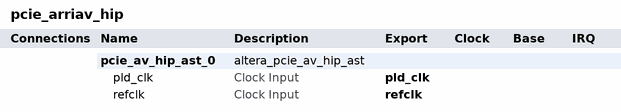
[diagram p0: system contents]
# Platform Designer (Qsys) system pcie_arriav_hip, Arria V 5AGTFC7H3F35I3
# Parameters at their usual value, and those the tool derives, are not listed.
package require -exact qsys 21.1
create_system pcie_arriav_hip
set_project_property DEVICE_FAMILY {Arria V}
set_project_property DEVICE 5AGTFC7H3F35I3

add_instance pcie_av_hip_ast_0 altera_pcie_av_hip_ast 21.1
set_instance_parameter_value pcie_av_hip_ast_0 ACDS_VERSION_HWTCL 21.1
set_instance_parameter_value pcie_av_hip_ast_0 advanced_default_parameter_override 0
set_instance_parameter_value pcie_av_hip_ast_0 altpcie_avmm_hwtcl 0
set_instance_parameter_value pcie_av_hip_ast_0 ast_width_hwtcl {Avalon-ST 64-bit}
set_instance_parameter_value pcie_av_hip_ast_0 bar0_size_mask_0_hwtcl 28
set_instance_parameter_value pcie_av_hip_ast_0 bar0_size_mask_1_hwtcl 28
set_instance_parameter_value pcie_av_hip_ast_0 bar0_size_mask_2_hwtcl 28
set_instance_parameter_value pcie_av_hip_ast_0 bar0_size_mask_3_hwtcl 28
set_instance_parameter_value pcie_av_hip_ast_0 bar0_size_mask_4_hwtcl 28
set_instance_parameter_value pcie_av_hip_ast_0 bar0_size_mask_5_hwtcl 28
set_instance_parameter_value pcie_av_hip_ast_0 bar0_size_mask_6_hwtcl 28
set_instance_parameter_value pcie_av_hip_ast_0 bar0_size_mask_7_hwtcl 28
set_instance_parameter_value pcie_av_hip_ast_0 bar0_type_0_hwtcl 1
set_instance_parameter_value pcie_av_hip_ast_0 bar0_type_1_hwtcl 1
set_instance_parameter_value pcie_av_hip_ast_0 bar0_type_2_hwtcl 1
set_instance_parameter_value pcie_av_hip_ast_0 bar0_type_3_hwtcl 1
set_instance_parameter_value pcie_av_hip_ast_0 bar0_type_4_hwtcl 1
set_instance_parameter_value pcie_av_hip_ast_0 bar0_type_5_hwtcl 1
set_instance_parameter_value pcie_av_hip_ast_0 bar0_type_6_hwtcl 1
set_instance_parameter_value pcie_av_hip_ast_0 bar0_type_7_hwtcl 1
set_instance_parameter_value pcie_av_hip_ast_0 bar1_size_mask_0_hwtcl 0
set_instance_parameter_value pcie_av_hip_ast_0 bar1_size_mask_1_hwtcl 0
set_instance_parameter_value pcie_av_hip_ast_0 bar1_size_mask_2_hwtcl 0
set_instance_parameter_value pcie_av_hip_ast_0 bar1_size_mask_3_hwtcl 0
set_instance_parameter_value pcie_av_hip_ast_0 bar1_size_mask_4_hwtcl 0
set_instance_parameter_value pcie_av_hip_ast_0 bar1_size_mask_5_hwtcl 0
set_instance_parameter_value pcie_av_hip_ast_0 bar1_size_mask_6_hwtcl 0
set_instance_parameter_value pcie_av_hip_ast_0 bar1_size_mask_7_hwtcl 0
set_instance_parameter_value pcie_av_hip_ast_0 bar1_type_0_hwtcl 0
set_instance_parameter_value pcie_av_hip_ast_0 bar1_type_1_hwtcl 0
set_instance_parameter_value pcie_av_hip_ast_0 bar1_type_2_hwtcl 0
set_instance_parameter_value pcie_av_hip_ast_0 bar1_type_3_hwtcl 0
set_instance_parameter_value pcie_av_hip_ast_0 bar1_type_4_hwtcl 0
set_instance_parameter_value pcie_av_hip_ast_0 bar1_type_5_hwtcl 0
set_instance_parameter_value pcie_av_hip_ast_0 bar1_type_6_hwtcl 0
set_instance_parameter_value pcie_av_hip_ast_0 bar1_type_7_hwtcl 0
set_instance_parameter_value pcie_av_hip_ast_0 bar2_size_mask_0_hwtcl 0
set_instance_parameter_value pcie_av_hip_ast_0 bar2_size_mask_1_hwtcl 0
set_instance_parameter_value pcie_av_hip_ast_0 bar2_size_mask_2_hwtcl 0
set_instance_parameter_value pcie_av_hip_ast_0 bar2_size_mask_3_hwtcl 0
set_instance_parameter_value pcie_av_hip_ast_0 bar2_size_mask_4_hwtcl 0
set_instance_parameter_value pcie_av_hip_ast_0 bar2_size_mask_5_hwtcl 0
set_instance_parameter_value pcie_av_hip_ast_0 bar2_size_mask_6_hwtcl 0
set_instance_parameter_value pcie_av_hip_ast_0 bar2_size_mask_7_hwtcl 0
set_instance_parameter_value pcie_av_hip_ast_0 bar2_type_0_hwtcl 0
set_instance_parameter_value pcie_av_hip_ast_0 bar2_type_1_hwtcl 0
set_instance_parameter_value pcie_av_hip_ast_0 bar2_type_2_hwtcl 0
set_instance_parameter_value pcie_av_hip_ast_0 bar2_type_3_hwtcl 0
set_instance_parameter_value pcie_av_hip_ast_0 bar2_type_4_hwtcl 0
set_instance_parameter_value pcie_av_hip_ast_0 bar2_type_5_hwtcl 0
set_instance_parameter_value pcie_av_hip_ast_0 bar2_type_6_hwtcl 0
set_instance_parameter_value pcie_av_hip_ast_0 bar2_type_7_hwtcl 0
set_instance_parameter_value pcie_av_hip_ast_0 bar3_size_mask_0_hwtcl 0
set_instance_parameter_value pcie_av_hip_ast_0 bar3_size_mask_1_hwtcl 0
set_instance_parameter_value pcie_av_hip_ast_0 bar3_size_mask_2_hwtcl 0
set_instance_parameter_value pcie_av_hip_ast_0 bar3_size_mask_3_hwtcl 0
set_instance_parameter_value pcie_av_hip_ast_0 bar3_size_mask_4_hwtcl 0
set_instance_parameter_value pcie_av_hip_ast_0 bar3_size_mask_5_hwtcl 0
set_instance_parameter_value pcie_av_hip_ast_0 bar3_size_mask_6_hwtcl 0
set_instance_parameter_value pcie_av_hip_ast_0 bar3_size_mask_7_hwtcl 0
set_instance_parameter_value pcie_av_hip_ast_0 bar3_type_0_hwtcl 0
set_instance_parameter_value pcie_av_hip_ast_0 bar3_type_1_hwtcl 0
set_instance_parameter_value pcie_av_hip_ast_0 bar3_type_2_hwtcl 0
set_instance_parameter_value pcie_av_hip_ast_0 bar3_type_3_hwtcl 0
set_instance_parameter_value pcie_av_hip_ast_0 bar3_type_4_hwtcl 0
set_instance_parameter_value pcie_av_hip_ast_0 bar3_type_5_hwtcl 0
set_instance_parameter_value pcie_av_hip_ast_0 bar3_type_6_hwtcl 0
set_instance_parameter_value pcie_av_hip_ast_0 bar3_type_7_hwtcl 0
set_instance_parameter_value pcie_av_hip_ast_0 bar4_size_mask_0_hwtcl 0
set_instance_parameter_value pcie_av_hip_ast_0 bar4_size_mask_1_hwtcl 0
set_instance_parameter_value pcie_av_hip_ast_0 bar4_size_mask_2_hwtcl 0
set_instance_parameter_value pcie_av_hip_ast_0 bar4_size_mask_3_hwtcl 0
set_instance_parameter_value pcie_av_hip_ast_0 bar4_size_mask_4_hwtcl 0
set_instance_parameter_value pcie_av_hip_ast_0 bar4_size_mask_5_hwtcl 0
set_instance_parameter_value pcie_av_hip_ast_0 bar4_size_mask_6_hwtcl 0
set_instance_parameter_value pcie_av_hip_ast_0 bar4_size_mask_7_hwtcl 0
set_instance_parameter_value pcie_av_hip_ast_0 bar4_type_0_hwtcl 0
set_instance_parameter_value pcie_av_hip_ast_0 bar4_type_1_hwtcl 0
set_instance_parameter_value pcie_av_hip_ast_0 bar4_type_2_hwtcl 0
set_instance_parameter_value pcie_av_hip_ast_0 bar4_type_3_hwtcl 0
set_instance_parameter_value pcie_av_hip_ast_0 bar4_type_4_hwtcl 0
set_instance_parameter_value pcie_av_hip_ast_0 bar4_type_5_hwtcl 0
set_instance_parameter_value pcie_av_hip_ast_0 bar4_type_6_hwtcl 0
set_instance_parameter_value pcie_av_hip_ast_0 bar4_type_7_hwtcl 0
set_instance_parameter_value pcie_av_hip_ast_0 bar5_size_mask_0_hwtcl 0
set_instance_parameter_value pcie_av_hip_ast_0 bar5_size_mask_1_hwtcl 0
set_instance_parameter_value pcie_av_hip_ast_0 bar5_size_mask_2_hwtcl 0
set_instance_parameter_value pcie_av_hip_ast_0 bar5_size_mask_3_hwtcl 0
set_instance_parameter_value pcie_av_hip_ast_0 bar5_size_mask_4_hwtcl 0
set_instance_parameter_value pcie_av_hip_ast_0 bar5_size_mask_5_hwtcl 0
set_instance_parameter_value pcie_av_hip_ast_0 bar5_size_mask_6_hwtcl 0
set_instance_parameter_value pcie_av_hip_ast_0 bar5_size_mask_7_hwtcl 0
set_instance_parameter_value pcie_av_hip_ast_0 bar5_type_0_hwtcl 0
set_instance_parameter_value pcie_av_hip_ast_0 bar5_type_1_hwtcl 0
set_instance_parameter_value pcie_av_hip_ast_0 bar5_type_2_hwtcl 0
set_instance_parameter_value pcie_av_hip_ast_0 bar5_type_3_hwtcl 0
set_instance_parameter_value pcie_av_hip_ast_0 bar5_type_4_hwtcl 0
set_instance_parameter_value pcie_av_hip_ast_0 bar5_type_5_hwtcl 0
set_instance_parameter_value pcie_av_hip_ast_0 bar5_type_6_hwtcl 0
set_instance_parameter_value pcie_av_hip_ast_0 bar5_type_7_hwtcl 0
set_instance_parameter_value pcie_av_hip_ast_0 bridge_port_ssid_support_0_hwtcl false
set_instance_parameter_value pcie_av_hip_ast_0 bridge_port_ssid_support_1_hwtcl false
set_instance_parameter_value pcie_av_hip_ast_0 bridge_port_ssid_support_2_hwtcl false
set_instance_parameter_value pcie_av_hip_ast_0 bridge_port_ssid_support_3_hwtcl false
set_instance_parameter_value pcie_av_hip_ast_0 bridge_port_ssid_support_4_hwtcl false
set_instance_parameter_value pcie_av_hip_ast_0 bridge_port_ssid_support_5_hwtcl false
set_instance_parameter_value pcie_av_hip_ast_0 bridge_port_ssid_support_6_hwtcl false
set_instance_parameter_value pcie_av_hip_ast_0 bridge_port_ssid_support_7_hwtcl false
set_instance_parameter_value pcie_av_hip_ast_0 bridge_port_vga_enable_0_hwtcl false
set_instance_parameter_value pcie_av_hip_ast_0 bridge_port_vga_enable_1_hwtcl false
set_instance_parameter_value pcie_av_hip_ast_0 bridge_port_vga_enable_2_hwtcl false
set_instance_parameter_value pcie_av_hip_ast_0 bridge_port_vga_enable_3_hwtcl false
set_instance_parameter_value pcie_av_hip_ast_0 bridge_port_vga_enable_4_hwtcl false
set_instance_parameter_value pcie_av_hip_ast_0 bridge_port_vga_enable_5_hwtcl false
set_instance_parameter_value pcie_av_hip_ast_0 bridge_port_vga_enable_6_hwtcl false
set_instance_parameter_value pcie_av_hip_ast_0 bridge_port_vga_enable_7_hwtcl false
set_instance_parameter_value pcie_av_hip_ast_0 cdc_dummy_insert_limit_advanced_default_hwtcl 11
set_instance_parameter_value pcie_av_hip_ast_0 class_code_0_hwtcl 0
set_instance_parameter_value pcie_av_hip_ast_0 class_code_1_hwtcl 0
set_instance_parameter_value pcie_av_hip_ast_0 class_code_2_hwtcl 0
set_instance_parameter_value pcie_av_hip_ast_0 class_code_3_hwtcl 0
set_instance_parameter_value pcie_av_hip_ast_0 class_code_4_hwtcl 0
set_instance_parameter_value pcie_av_hip_ast_0 class_code_5_hwtcl 0
set_instance_parameter_value pcie_av_hip_ast_0 class_code_6_hwtcl 0
set_instance_parameter_value pcie_av_hip_ast_0 class_code_7_hwtcl 0
set_instance_parameter_value pcie_av_hip_ast_0 completion_timeout_hwtcl ABCD
set_instance_parameter_value pcie_av_hip_ast_0 d0_pme_advanced_default_hwtcl false
set_instance_parameter_value pcie_av_hip_ast_0 d1_pme_advanced_default_hwtcl false
set_instance_parameter_value pcie_av_hip_ast_0 d1_support_advanced_default_hwtcl false
set_instance_parameter_value pcie_av_hip_ast_0 d2_pme_advanced_default_hwtcl false
set_instance_parameter_value pcie_av_hip_ast_0 d2_support_advanced_default_hwtcl false
set_instance_parameter_value pcie_av_hip_ast_0 d3_cold_pme_advanced_default_hwtcl false
set_instance_parameter_value pcie_av_hip_ast_0 d3_hot_pme_advanced_default_hwtcl false
set_instance_parameter_value pcie_av_hip_ast_0 deemphasis_enable_advanced_default_hwtcl false
set_instance_parameter_value pcie_av_hip_ast_0 device_id_0_hwtcl 1
set_instance_parameter_value pcie_av_hip_ast_0 device_id_1_hwtcl 1
set_instance_parameter_value pcie_av_hip_ast_0 device_id_2_hwtcl 1
set_instance_parameter_value pcie_av_hip_ast_0 device_id_3_hwtcl 1
set_instance_parameter_value pcie_av_hip_ast_0 device_id_4_hwtcl 1
set_instance_parameter_value pcie_av_hip_ast_0 device_id_5_hwtcl 1
set_instance_parameter_value pcie_av_hip_ast_0 device_id_6_hwtcl 1
set_instance_parameter_value pcie_av_hip_ast_0 device_id_7_hwtcl 1
set_instance_parameter_value pcie_av_hip_ast_0 device_number_advanced_default_hwtcl 0
set_instance_parameter_value pcie_av_hip_ast_0 diffclock_nfts_count_advanced_default_hwtcl 255
set_instance_parameter_value pcie_av_hip_ast_0 disable_link_x2_support_advanced_default_hwtcl false
set_instance_parameter_value pcie_av_hip_ast_0 disable_snoop_packet_0_hwtcl false
set_instance_parameter_value pcie_av_hip_ast_0 disable_snoop_packet_1_hwtcl false
set_instance_parameter_value pcie_av_hip_ast_0 disable_snoop_packet_2_hwtcl false
set_instance_parameter_value pcie_av_hip_ast_0 disable_snoop_packet_3_hwtcl false
set_instance_parameter_value pcie_av_hip_ast_0 disable_snoop_packet_4_hwtcl false
set_instance_parameter_value pcie_av_hip_ast_0 disable_snoop_packet_5_hwtcl false
set_instance_parameter_value pcie_av_hip_ast_0 disable_snoop_packet_6_hwtcl false
set_instance_parameter_value pcie_av_hip_ast_0 disable_snoop_packet_7_hwtcl false
set_instance_parameter_value pcie_av_hip_ast_0 dll_active_report_support_0_hwtcl 0
set_instance_parameter_value pcie_av_hip_ast_0 dll_active_report_support_1_hwtcl 0
set_instance_parameter_value pcie_av_hip_ast_0 dll_active_report_support_2_hwtcl 0
set_instance_parameter_value pcie_av_hip_ast_0 dll_active_report_support_3_hwtcl 0
set_instance_parameter_value pcie_av_hip_ast_0 dll_active_report_support_4_hwtcl 0
set_instance_parameter_value pcie_av_hip_ast_0 dll_active_report_support_5_hwtcl 0
set_instance_parameter_value pcie_av_hip_ast_0 dll_active_report_support_6_hwtcl 0
set_instance_parameter_value pcie_av_hip_ast_0 dll_active_report_support_7_hwtcl 0
set_instance_parameter_value pcie_av_hip_ast_0 ecrc_check_capable_hwtcl 0
set_instance_parameter_value pcie_av_hip_ast_0 ecrc_gen_capable_hwtcl 0
set_instance_parameter_value pcie_av_hip_ast_0 ei_delay_powerdown_count_advanced_default_hwtcl 10
set_instance_parameter_value pcie_av_hip_ast_0 eie_before_nfts_count_advanced_default_hwtcl 4
set_instance_parameter_value pcie_av_hip_ast_0 enable_completion_timeout_disable_hwtcl 1
set_instance_parameter_value pcie_av_hip_ast_0 enable_function_msix_support_0_hwtcl 0
set_instance_parameter_value pcie_av_hip_ast_0 enable_function_msix_support_1_hwtcl 0
set_instance_parameter_value pcie_av_hip_ast_0 enable_function_msix_support_2_hwtcl 0
set_instance_parameter_value pcie_av_hip_ast_0 enable_function_msix_support_3_hwtcl 0
set_instance_parameter_value pcie_av_hip_ast_0 enable_function_msix_support_4_hwtcl 0
set_instance_parameter_value pcie_av_hip_ast_0 enable_function_msix_support_5_hwtcl 0
set_instance_parameter_value pcie_av_hip_ast_0 enable_function_msix_support_6_hwtcl 0
set_instance_parameter_value pcie_av_hip_ast_0 enable_function_msix_support_7_hwtcl 0
set_instance_parameter_value pcie_av_hip_ast_0 enable_l1_aspm_advanced_default_hwtcl false
set_instance_parameter_value pcie_av_hip_ast_0 enable_rx_buffer_checking_advanced_default_hwtcl false
set_instance_parameter_value pcie_av_hip_ast_0 enable_slot_register_hwtcl 0
set_instance_parameter_value pcie_av_hip_ast_0 endpoint_l0_latency_hwtcl 0
set_instance_parameter_value pcie_av_hip_ast_0 endpoint_l1_latency_hwtcl 0
set_instance_parameter_value pcie_av_hip_ast_0 expansion_base_address_register_0_hwtcl 0
set_instance_parameter_value pcie_av_hip_ast_0 expansion_base_address_register_1_hwtcl 0
set_instance_parameter_value pcie_av_hip_ast_0 expansion_base_address_register_2_hwtcl 0
set_instance_parameter_value pcie_av_hip_ast_0 expansion_base_address_register_3_hwtcl 0
set_instance_parameter_value pcie_av_hip_ast_0 expansion_base_address_register_4_hwtcl 0
set_instance_parameter_value pcie_av_hip_ast_0 expansion_base_address_register_5_hwtcl 0
set_instance_parameter_value pcie_av_hip_ast_0 expansion_base_address_register_6_hwtcl 0
set_instance_parameter_value pcie_av_hip_ast_0 expansion_base_address_register_7_hwtcl 0
set_instance_parameter_value pcie_av_hip_ast_0 extend_tag_field_hwtcl 32
set_instance_parameter_value pcie_av_hip_ast_0 fc_init_timer_advanced_default_hwtcl 1024
set_instance_parameter_value pcie_av_hip_ast_0 flow_control_timeout_count_advanced_default_hwtcl 200
set_instance_parameter_value pcie_av_hip_ast_0 flow_control_update_count_advanced_default_hwtcl 30
set_instance_parameter_value pcie_av_hip_ast_0 flr_capability_0_hwtcl 0
set_instance_parameter_value pcie_av_hip_ast_0 flr_capability_1_hwtcl 0
set_instance_parameter_value pcie_av_hip_ast_0 flr_capability_2_hwtcl 0
set_instance_parameter_value pcie_av_hip_ast_0 flr_capability_3_hwtcl 0
set_instance_parameter_value pcie_av_hip_ast_0 flr_capability_4_hwtcl 0
set_instance_parameter_value pcie_av_hip_ast_0 flr_capability_5_hwtcl 0
set_instance_parameter_value pcie_av_hip_ast_0 flr_capability_6_hwtcl 0
set_instance_parameter_value pcie_av_hip_ast_0 flr_capability_7_hwtcl 0
set_instance_parameter_value pcie_av_hip_ast_0 force_hrc 0
set_instance_parameter_value pcie_av_hip_ast_0 force_src 0
set_instance_parameter_value pcie_av_hip_ast_0 gen12_lane_rate_mode_hwtcl {Gen1 (2.5 Gbps)}
set_instance_parameter_value pcie_av_hip_ast_0 gen2_diffclock_nfts_count_advanced_default_hwtcl 255
set_instance_parameter_value pcie_av_hip_ast_0 gen2_sameclock_nfts_count_advanced_default_hwtcl 255
set_instance_parameter_value pcie_av_hip_ast_0 hip_reconfig_hwtcl 0
set_instance_parameter_value pcie_av_hip_ast_0 hot_plug_support_advanced_default_hwtcl 0
set_instance_parameter_value pcie_av_hip_ast_0 in_cvp_mode_hwtcl 0
set_instance_parameter_value pcie_av_hip_ast_0 indicator_advanced_default_hwtcl 0
set_instance_parameter_value pcie_av_hip_ast_0 interrupt_pin_0_hwtcl inta
set_instance_parameter_value pcie_av_hip_ast_0 interrupt_pin_1_hwtcl inta
set_instance_parameter_value pcie_av_hip_ast_0 interrupt_pin_2_hwtcl inta
set_instance_parameter_value pcie_av_hip_ast_0 interrupt_pin_3_hwtcl inta
set_instance_parameter_value pcie_av_hip_ast_0 interrupt_pin_4_hwtcl inta
set_instance_parameter_value pcie_av_hip_ast_0 interrupt_pin_5_hwtcl inta
set_instance_parameter_value pcie_av_hip_ast_0 interrupt_pin_6_hwtcl inta
set_instance_parameter_value pcie_av_hip_ast_0 interrupt_pin_7_hwtcl inta
set_instance_parameter_value pcie_av_hip_ast_0 io_window_addr_width_hwtcl 0
set_instance_parameter_value pcie_av_hip_ast_0 l01_entry_latency_advanced_default_hwtcl 31
set_instance_parameter_value pcie_av_hip_ast_0 l0_exit_latency_diffclock_advanced_default_hwtcl 6
set_instance_parameter_value pcie_av_hip_ast_0 l0_exit_latency_sameclock_advanced_default_hwtcl 6
set_instance_parameter_value pcie_av_hip_ast_0 l1_exit_latency_diffclock_advanced_default_hwtcl 0
set_instance_parameter_value pcie_av_hip_ast_0 l1_exit_latency_sameclock_advanced_default_hwtcl 0
set_instance_parameter_value pcie_av_hip_ast_0 l2_async_logic_advanced_default_hwtcl disable
set_instance_parameter_value pcie_av_hip_ast_0 lane_mask_hwtcl x1
set_instance_parameter_value pcie_av_hip_ast_0 low_priority_vc_advanced_default_hwtcl single_vc
set_instance_parameter_value pcie_av_hip_ast_0 max_payload_size_hwtcl 128
set_instance_parameter_value pcie_av_hip_ast_0 maximum_current_0_hwtcl 0
set_instance_parameter_value pcie_av_hip_ast_0 maximum_current_1_hwtcl 0
set_instance_parameter_value pcie_av_hip_ast_0 maximum_current_2_hwtcl 0
set_instance_parameter_value pcie_av_hip_ast_0 maximum_current_3_hwtcl 0
set_instance_parameter_value pcie_av_hip_ast_0 maximum_current_4_hwtcl 0
set_instance_parameter_value pcie_av_hip_ast_0 maximum_current_5_hwtcl 0
set_instance_parameter_value pcie_av_hip_ast_0 maximum_current_6_hwtcl 0
set_instance_parameter_value pcie_av_hip_ast_0 maximum_current_7_hwtcl 0
set_instance_parameter_value pcie_av_hip_ast_0 msi_64bit_addressing_capable_0_hwtcl true
set_instance_parameter_value pcie_av_hip_ast_0 msi_64bit_addressing_capable_1_hwtcl true
set_instance_parameter_value pcie_av_hip_ast_0 msi_64bit_addressing_capable_2_hwtcl true
set_instance_parameter_value pcie_av_hip_ast_0 msi_64bit_addressing_capable_3_hwtcl true
set_instance_parameter_value pcie_av_hip_ast_0 msi_64bit_addressing_capable_4_hwtcl true
set_instance_parameter_value pcie_av_hip_ast_0 msi_64bit_addressing_capable_5_hwtcl true
set_instance_parameter_value pcie_av_hip_ast_0 msi_64bit_addressing_capable_6_hwtcl true
set_instance_parameter_value pcie_av_hip_ast_0 msi_64bit_addressing_capable_7_hwtcl true
set_instance_parameter_value pcie_av_hip_ast_0 msi_masking_capable_0_hwtcl false
set_instance_parameter_value pcie_av_hip_ast_0 msi_masking_capable_1_hwtcl false
set_instance_parameter_value pcie_av_hip_ast_0 msi_masking_capable_2_hwtcl false
set_instance_parameter_value pcie_av_hip_ast_0 msi_masking_capable_3_hwtcl false
set_instance_parameter_value pcie_av_hip_ast_0 msi_masking_capable_4_hwtcl false
set_instance_parameter_value pcie_av_hip_ast_0 msi_masking_capable_5_hwtcl false
set_instance_parameter_value pcie_av_hip_ast_0 msi_masking_capable_6_hwtcl false
set_instance_parameter_value pcie_av_hip_ast_0 msi_masking_capable_7_hwtcl false
set_instance_parameter_value pcie_av_hip_ast_0 msi_multi_message_capable_0_hwtcl 4
set_instance_parameter_value pcie_av_hip_ast_0 msi_multi_message_capable_1_hwtcl 4
set_instance_parameter_value pcie_av_hip_ast_0 msi_multi_message_capable_2_hwtcl 4
set_instance_parameter_value pcie_av_hip_ast_0 msi_multi_message_capable_3_hwtcl 4
set_instance_parameter_value pcie_av_hip_ast_0 msi_multi_message_capable_4_hwtcl 4
set_instance_parameter_value pcie_av_hip_ast_0 msi_multi_message_capable_5_hwtcl 4
set_instance_parameter_value pcie_av_hip_ast_0 msi_multi_message_capable_6_hwtcl 4
set_instance_parameter_value pcie_av_hip_ast_0 msi_multi_message_capable_7_hwtcl 4
set_instance_parameter_value pcie_av_hip_ast_0 msi_support_0_hwtcl true
set_instance_parameter_value pcie_av_hip_ast_0 msi_support_1_hwtcl true
set_instance_parameter_value pcie_av_hip_ast_0 msi_support_2_hwtcl true
set_instance_parameter_value pcie_av_hip_ast_0 msi_support_3_hwtcl true
set_instance_parameter_value pcie_av_hip_ast_0 msi_support_4_hwtcl true
set_instance_parameter_value pcie_av_hip_ast_0 msi_support_5_hwtcl true
set_instance_parameter_value pcie_av_hip_ast_0 msi_support_6_hwtcl true
set_instance_parameter_value pcie_av_hip_ast_0 msi_support_7_hwtcl true
set_instance_parameter_value pcie_av_hip_ast_0 msix_pba_bir_0_hwtcl 0
set_instance_parameter_value pcie_av_hip_ast_0 msix_pba_bir_1_hwtcl 0
set_instance_parameter_value pcie_av_hip_ast_0 msix_pba_bir_2_hwtcl 0
set_instance_parameter_value pcie_av_hip_ast_0 msix_pba_bir_3_hwtcl 0
set_instance_parameter_value pcie_av_hip_ast_0 msix_pba_bir_4_hwtcl 0
set_instance_parameter_value pcie_av_hip_ast_0 msix_pba_bir_5_hwtcl 0
set_instance_parameter_value pcie_av_hip_ast_0 msix_pba_bir_6_hwtcl 0
set_instance_parameter_value pcie_av_hip_ast_0 msix_pba_bir_7_hwtcl 0
set_instance_parameter_value pcie_av_hip_ast_0 msix_pba_offset_0_hwtcl 0
set_instance_parameter_value pcie_av_hip_ast_0 msix_pba_offset_1_hwtcl 0
set_instance_parameter_value pcie_av_hip_ast_0 msix_pba_offset_2_hwtcl 0
set_instance_parameter_value pcie_av_hip_ast_0 msix_pba_offset_3_hwtcl 0
set_instance_parameter_value pcie_av_hip_ast_0 msix_pba_offset_4_hwtcl 0
set_instance_parameter_value pcie_av_hip_ast_0 msix_pba_offset_5_hwtcl 0
set_instance_parameter_value pcie_av_hip_ast_0 msix_pba_offset_6_hwtcl 0
set_instance_parameter_value pcie_av_hip_ast_0 msix_pba_offset_7_hwtcl 0
set_instance_parameter_value pcie_av_hip_ast_0 msix_table_bir_0_hwtcl 0
set_instance_parameter_value pcie_av_hip_ast_0 msix_table_bir_1_hwtcl 0
set_instance_parameter_value pcie_av_hip_ast_0 msix_table_bir_2_hwtcl 0
set_instance_parameter_value pcie_av_hip_ast_0 msix_table_bir_3_hwtcl 0
set_instance_parameter_value pcie_av_hip_ast_0 msix_table_bir_4_hwtcl 0
set_instance_parameter_value pcie_av_hip_ast_0 msix_table_bir_5_hwtcl 0
set_instance_parameter_value pcie_av_hip_ast_0 msix_table_bir_6_hwtcl 0
set_instance_parameter_value pcie_av_hip_ast_0 msix_table_bir_7_hwtcl 0
set_instance_parameter_value pcie_av_hip_ast_0 msix_table_offset_0_hwtcl 0
set_instance_parameter_value pcie_av_hip_ast_0 msix_table_offset_1_hwtcl 0
set_instance_parameter_value pcie_av_hip_ast_0 msix_table_offset_2_hwtcl 0
set_instance_parameter_value pcie_av_hip_ast_0 msix_table_offset_3_hwtcl 0
set_instance_parameter_value pcie_av_hip_ast_0 msix_table_offset_4_hwtcl 0
set_instance_parameter_value pcie_av_hip_ast_0 msix_table_offset_5_hwtcl 0
set_instance_parameter_value pcie_av_hip_ast_0 msix_table_offset_6_hwtcl 0
set_instance_parameter_value pcie_av_hip_ast_0 msix_table_offset_7_hwtcl 0
set_instance_parameter_value pcie_av_hip_ast_0 msix_table_size_0_hwtcl 0
set_instance_parameter_value pcie_av_hip_ast_0 msix_table_size_1_hwtcl 0
set_instance_parameter_value pcie_av_hip_ast_0 msix_table_size_2_hwtcl 0
set_instance_parameter_value pcie_av_hip_ast_0 msix_table_size_3_hwtcl 0
set_instance_parameter_value pcie_av_hip_ast_0 msix_table_size_4_hwtcl 0
set_instance_parameter_value pcie_av_hip_ast_0 msix_table_size_5_hwtcl 0
set_instance_parameter_value pcie_av_hip_ast_0 msix_table_size_6_hwtcl 0
set_instance_parameter_value pcie_av_hip_ast_0 msix_table_size_7_hwtcl 0
set_instance_parameter_value pcie_av_hip_ast_0 no_command_completed_advanced_default_hwtcl false
set_instance_parameter_value pcie_av_hip_ast_0 no_soft_reset_advanced_default_hwtcl false
set_instance_parameter_value pcie_av_hip_ast_0 num_of_func_hwtcl 1
set_instance_parameter_value pcie_av_hip_ast_0 override_rxbuffer_cred_preset 0
set_instance_parameter_value pcie_av_hip_ast_0 override_tbpartner_driver_setting_hwtcl 0
set_instance_parameter_value pcie_av_hip_ast_0 pcie_qsys 1
set_instance_parameter_value pcie_av_hip_ast_0 pcie_spec_version_hwtcl 2.1
set_instance_parameter_value pcie_av_hip_ast_0 pclk_out_sel_advanced_default_hwtcl pclk
set_instance_parameter_value pcie_av_hip_ast_0 pipex1_debug_sel_advanced_default_hwtcl disable
set_instance_parameter_value pcie_av_hip_ast_0 pll_refclk_freq_hwtcl {100 MHz}
set_instance_parameter_value pcie_av_hip_ast_0 port_link_number_hwtcl 1
set_instance_parameter_value pcie_av_hip_ast_0 porttype_func_hwtcl {Root port}
set_instance_parameter_value pcie_av_hip_ast_0 prefetchable_mem_window_addr_width_hwtcl 0
set_instance_parameter_value pcie_av_hip_ast_0 register_pipe_signals_advanced_default_hwtcl true
set_instance_parameter_value pcie_av_hip_ast_0 reserved_debug_advanced_default_hwtcl 0
set_instance_parameter_value pcie_av_hip_ast_0 retry_buffer_last_active_address_advanced_default_hwtcl 255
set_instance_parameter_value pcie_av_hip_ast_0 revision_id_0_hwtcl 1
set_instance_parameter_value pcie_av_hip_ast_0 revision_id_1_hwtcl 1
set_instance_parameter_value pcie_av_hip_ast_0 revision_id_2_hwtcl 1
set_instance_parameter_value pcie_av_hip_ast_0 revision_id_3_hwtcl 1
set_instance_parameter_value pcie_av_hip_ast_0 revision_id_4_hwtcl 1
set_instance_parameter_value pcie_av_hip_ast_0 revision_id_5_hwtcl 1
set_instance_parameter_value pcie_av_hip_ast_0 revision_id_6_hwtcl 1
set_instance_parameter_value pcie_av_hip_ast_0 revision_id_7_hwtcl 1
set_instance_parameter_value pcie_av_hip_ast_0 rpre_emph_a_val_hwtcl 12
set_instance_parameter_value pcie_av_hip_ast_0 rpre_emph_b_val_hwtcl 0
set_instance_parameter_value pcie_av_hip_ast_0 rpre_emph_c_val_hwtcl 19
set_instance_parameter_value pcie_av_hip_ast_0 rpre_emph_d_val_hwtcl 13
set_instance_parameter_value pcie_av_hip_ast_0 rpre_emph_e_val_hwtcl 21
set_instance_parameter_value pcie_av_hip_ast_0 rvod_sel_a_val_hwtcl 42
set_instance_parameter_value pcie_av_hip_ast_0 rvod_sel_b_val_hwtcl 30
set_instance_parameter_value pcie_av_hip_ast_0 rvod_sel_c_val_hwtcl 43
set_instance_parameter_value pcie_av_hip_ast_0 rvod_sel_d_val_hwtcl 43
set_instance_parameter_value pcie_av_hip_ast_0 rvod_sel_e_val_hwtcl 9
set_instance_parameter_value pcie_av_hip_ast_0 rx_cdc_almost_full_advanced_default_hwtcl 12
set_instance_parameter_value pcie_av_hip_ast_0 rx_l0s_count_idl_advanced_default_hwtcl 0
set_instance_parameter_value pcie_av_hip_ast_0 rxbuffer_rxreq_hwtcl Minimum
set_instance_parameter_value pcie_av_hip_ast_0 sameclock_nfts_count_advanced_default_hwtcl 255
set_instance_parameter_value pcie_av_hip_ast_0 serial_sim_hwtcl 0
set_instance_parameter_value pcie_av_hip_ast_0 set_l0s_hwtcl 0
set_instance_parameter_value pcie_av_hip_ast_0 set_pld_clk_x1_625MHz_hwtcl 0
set_instance_parameter_value pcie_av_hip_ast_0 skp_os_schedule_count_advanced_default_hwtcl 0
set_instance_parameter_value pcie_av_hip_ast_0 slot_number_hwtcl 0
set_instance_parameter_value pcie_av_hip_ast_0 slot_power_limit_hwtcl 0
set_instance_parameter_value pcie_av_hip_ast_0 slot_power_scale_hwtcl 0
set_instance_parameter_value pcie_av_hip_ast_0 slotclkcfg_hwtcl 1
set_instance_parameter_value pcie_av_hip_ast_0 ssid_0_hwtcl 0
set_instance_parameter_value pcie_av_hip_ast_0 ssid_1_hwtcl 0
set_instance_parameter_value pcie_av_hip_ast_0 ssid_2_hwtcl 0
set_instance_parameter_value pcie_av_hip_ast_0 ssid_3_hwtcl 0
set_instance_parameter_value pcie_av_hip_ast_0 ssid_4_hwtcl 0
set_instance_parameter_value pcie_av_hip_ast_0 ssid_5_hwtcl 0
set_instance_parameter_value pcie_av_hip_ast_0 ssid_6_hwtcl 0
set_instance_parameter_value pcie_av_hip_ast_0 ssid_7_hwtcl 0
set_instance_parameter_value pcie_av_hip_ast_0 ssvid_0_hwtcl 0
set_instance_parameter_value pcie_av_hip_ast_0 ssvid_1_hwtcl 0
set_instance_parameter_value pcie_av_hip_ast_0 ssvid_2_hwtcl 0
set_instance_parameter_value pcie_av_hip_ast_0 ssvid_3_hwtcl 0
set_instance_parameter_value pcie_av_hip_ast_0 ssvid_4_hwtcl 0
set_instance_parameter_value pcie_av_hip_ast_0 ssvid_5_hwtcl 0
set_instance_parameter_value pcie_av_hip_ast_0 ssvid_6_hwtcl 0
set_instance_parameter_value pcie_av_hip_ast_0 ssvid_7_hwtcl 0
set_instance_parameter_value pcie_av_hip_ast_0 subsystem_device_id_0_hwtcl 0
set_instance_parameter_value pcie_av_hip_ast_0 subsystem_device_id_1_hwtcl 0
set_instance_parameter_value pcie_av_hip_ast_0 subsystem_device_id_2_hwtcl 0
set_instance_parameter_value pcie_av_hip_ast_0 subsystem_device_id_3_hwtcl 0
set_instance_parameter_value pcie_av_hip_ast_0 subsystem_device_id_4_hwtcl 0
set_instance_parameter_value pcie_av_hip_ast_0 subsystem_device_id_5_hwtcl 0
set_instance_parameter_value pcie_av_hip_ast_0 subsystem_device_id_6_hwtcl 0
set_instance_parameter_value pcie_av_hip_ast_0 subsystem_device_id_7_hwtcl 0
set_instance_parameter_value pcie_av_hip_ast_0 subsystem_vendor_id_0_hwtcl 0
set_instance_parameter_value pcie_av_hip_ast_0 subsystem_vendor_id_1_hwtcl 0
set_instance_parameter_value pcie_av_hip_ast_0 subsystem_vendor_id_2_hwtcl 0
set_instance_parameter_value pcie_av_hip_ast_0 subsystem_vendor_id_3_hwtcl 0
set_instance_parameter_value pcie_av_hip_ast_0 subsystem_vendor_id_4_hwtcl 0
set_instance_parameter_value pcie_av_hip_ast_0 subsystem_vendor_id_5_hwtcl 0
set_instance_parameter_value pcie_av_hip_ast_0 subsystem_vendor_id_6_hwtcl 0
set_instance_parameter_value pcie_av_hip_ast_0 subsystem_vendor_id_7_hwtcl 0
set_instance_parameter_value pcie_av_hip_ast_0 surprise_down_error_support_0_hwtcl 0
set_instance_parameter_value pcie_av_hip_ast_0 surprise_down_error_support_1_hwtcl 0
set_instance_parameter_value pcie_av_hip_ast_0 surprise_down_error_support_2_hwtcl 0
set_instance_parameter_value pcie_av_hip_ast_0 surprise_down_error_support_3_hwtcl 0
set_instance_parameter_value pcie_av_hip_ast_0 surprise_down_error_support_4_hwtcl 0
set_instance_parameter_value pcie_av_hip_ast_0 surprise_down_error_support_5_hwtcl 0
set_instance_parameter_value pcie_av_hip_ast_0 surprise_down_error_support_6_hwtcl 0
set_instance_parameter_value pcie_av_hip_ast_0 surprise_down_error_support_7_hwtcl 0
set_instance_parameter_value pcie_av_hip_ast_0 tx_cdc_almost_empty_advanced_default_hwtcl 5
set_instance_parameter_value pcie_av_hip_ast_0 tx_cdc_almost_full_advanced_default_hwtcl 11
set_instance_parameter_value pcie_av_hip_ast_0 use_aer_hwtcl 0
set_instance_parameter_value pcie_av_hip_ast_0 use_crc_forwarding_hwtcl 0
set_instance_parameter_value pcie_av_hip_ast_0 use_rx_st_be_hwtcl 0
set_instance_parameter_value pcie_av_hip_ast_0 use_tl_cfg_sync_advanced_default_hwtcl 1
set_instance_parameter_value pcie_av_hip_ast_0 user_id_hwtcl 0
set_instance_parameter_value pcie_av_hip_ast_0 vc0_clk_enable_advanced_default_hwtcl true
set_instance_parameter_value pcie_av_hip_ast_0 vendor_id_0_hwtcl 0
set_instance_parameter_value pcie_av_hip_ast_0 vendor_id_1_hwtcl 0
set_instance_parameter_value pcie_av_hip_ast_0 vendor_id_2_hwtcl 0
set_instance_parameter_value pcie_av_hip_ast_0 vendor_id_3_hwtcl 0
set_instance_parameter_value pcie_av_hip_ast_0 vendor_id_4_hwtcl 0
set_instance_parameter_value pcie_av_hip_ast_0 vendor_id_5_hwtcl 0
set_instance_parameter_value pcie_av_hip_ast_0 vendor_id_6_hwtcl 0
set_instance_parameter_value pcie_av_hip_ast_0 vendor_id_7_hwtcl 0
set_instance_parameter_value pcie_av_hip_ast_0 vsec_id_hwtcl 4466
set_instance_parameter_value pcie_av_hip_ast_0 vsec_rev_hwtcl 0

# exported interfaces
add_interface pld_clk clock sink
set_interface_property pld_clk EXPORT_OF pcie_av_hip_ast_0.pld_clk
add_interface refclk clock sink
set_interface_property refclk EXPORT_OF pcie_av_hip_ast_0.refclk

set_interconnect_requirement {$system} qsys_mm.clockCrossingAdapter HANDSHAKE
set_interconnect_requirement {$system} qsys_mm.enableEccProtection FALSE
set_interconnect_requirement {$system} qsys_mm.insertDefaultSlave FALSE
set_interconnect_requirement {$system} qsys_mm.maxAdditionalLatency 1

save_system pcie_arriav_hip.qsys
